# Altium project IV_transform_circuit.PrjPcb
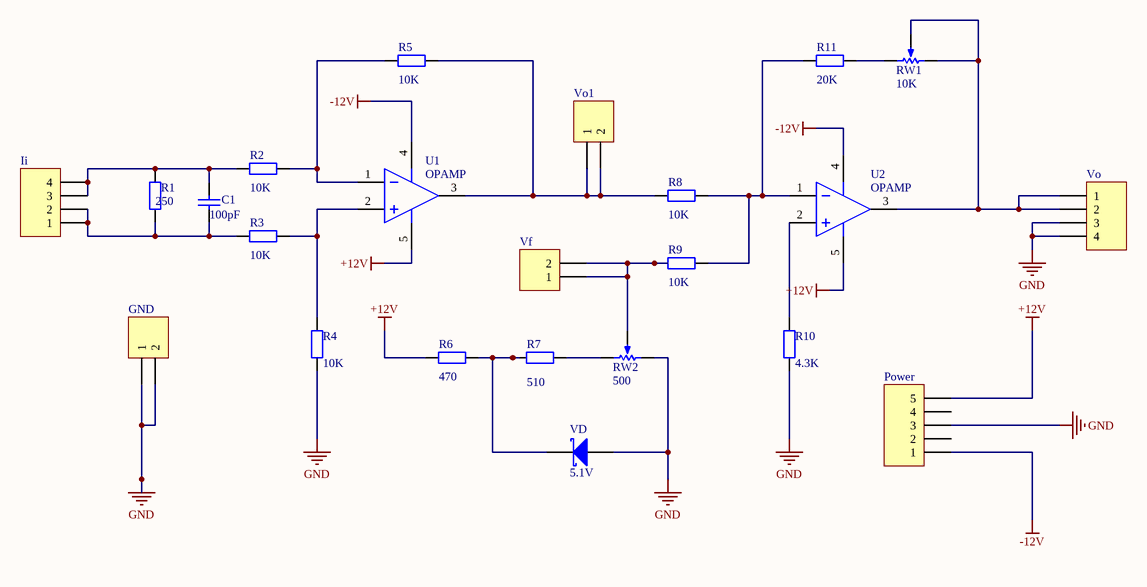
[diagram p0: IV_transform_circuit.SchDoc]
1 sheet, 23 parts. Net scope: global (net labels, ports and power ports of the same name join across sheets).
Board file: IV_transform_circuit.PcbDoc

## Sheet IV_transform_circuit.SchDoc
size A4; SheetNumber: 1; SheetTotal: 1

### Parts
C1  value 100pF  [RAD-0.2]  (hidden comment: Cap)
GND  Header 2  [SIP-2]  (value not drawn)
Ii  Header 4  [SIP-4]  (value not drawn)
Power  Header 5  [POWER PLUG5]  (value not drawn)
R1  value 250  [AXIAL-0.4]
R2  value 10K  [AXIAL-0.4]  (hidden comment: Res2)
R3  value 10K  [AXIAL-0.4]  (hidden comment: Res2)
R4  value 10K  [AXIAL-0.4]  (hidden comment: Res2)
R5  value 10K  [AXIAL-0.4]  (hidden comment: Res2)
R6  value 470  [AXIAL-0.4]  (hidden comment: Res2)
R7  value 510  [AXIAL-0.4]  (hidden comment: Res2)
R8  value 10K  [AXIAL-0.4]  (hidden comment: Res2)
R9  value 10K  [AXIAL-0.4]  (hidden comment: Res2)
R10  value 4.3K  [AXIAL-0.4]  (hidden comment: Res2)
R11  value 20K  [AXIAL-0.4]  (hidden comment: Res2)
RW1  value 10K  [VR5]  (hidden comment: RPot)
RW2  value 500  [VR5]  (hidden comment: RPot)
U1  OPAMP  [DIP-8]
U2  OPAMP  [DIP-8]
VD  5.1V  [DIODE-0.4]
Vf  Header 2  [SIP-2]  (value not drawn)
Vo  Header 4  [SIP-4]  (value not drawn)
Vo1  Header 2  [SIP-2]  (value not drawn)

### Nets
+12V: Power.5 R6.2 U1.5(V-) U2.5(V-)
-12V: Power.1 U1.4(V+) U2.4(V+)
GND: GND.1 GND.2 Power.3 R4.2 R10.2 RW2.1(TOP) VD.1(A) Vo.3 Vo.4
NetC1_1: C1.1 Ii.1 Ii.2 R1.1 R3.2
NetC1_2: C1.2 Ii.3 Ii.4 R1.2 R2.2
NetR2_1: R2.1 R5.2 U1.1(IN-)
NetR3_1: R3.1 R4.1 U1.2(IN+)
NetR5_1: R5.1 R8.2 U1.3(OUT) Vo1.1 Vo1.2
NetR6_1: R6.1 R7.2 VD.2(K)
NetR7_1: R7.1 RW2.2(BOT)
NetR8_1: R8.1 R9.1 R11.2 U2.1(IN-)
NetR9_2: R9.2 RW2.3(TAP) Vf.1 Vf.2
NetR10_1: R10.1 U2.2(IN+)
NetR11_1: R11.1 RW1.2(BOT)
NetRW1_1: RW1.1(TOP) RW1.3(TAP) U2.3(OUT) Vo.1 Vo.2

Not connected (* = marked no-connect by the designer): Power 2 4

### Library data of the parts
C1 = Cap: Capacitor; Published: 8-Jun-2000; LatestRevisionDate: 17-Jul-2002; LatestRevisionNote: Re-released for DXP Platform.; PackageReference: RAD-0.3; Publisher: Altium Limited; PackageDescription: Radial Cap, Thru-Hole; 2 Leads; 0.3 in Pin Spacing
GND Vf Vo1 = Header 2: Header, 2-Pin; LatestRevisionDate: 17-Jul-2002; LatestRevisionNote: Re-released for DXP Platform.; Publisher: Altium Limited
Ii Vo = Header 4: Header, 4-Pin; LatestRevisionDate: 17-Jul-2002; LatestRevisionNote: Re-released for DXP Platform.; Publisher: Altium Limited
Power = Header 5: Header, 5-Pin; LatestRevisionDate: 17-Jul-2002; LatestRevisionNote: Re-released for DXP Platform.; Publisher: Altium Limited
R1-R11 = Res2: Resistor; Published: 8-Jun-2000; LatestRevisionDate: 17-Jul-2002; LatestRevisionNote: Re-released for DXP Platform.; PackageReference: AXIAL-0.4; Publisher: Altium Limited; PackageDescription: Axial Device, Thru-Hole; 2 Leads; 0.4 in Pin Spacing
RW1 RW2 = RPot: Potentiometer; pin to pad: 2>3 3>2; Sim Note: Enter the Resistance value and the set point into parameter fields.; Set Position: 0.5; Published: 8-Jun-2000; LatestRevisionDate: 17-Jul-2002; LatestRevisionNote: Re-released for DXP Platform.; PackageReference: VR5; Publisher: Altium Limited; PackageDescription: Variable Resistor, Thru-Hole; 3 Leads
U1 U2 = OPAMP: Operational Amplifier; pin to pad: 1>2 2>3 3>6 5>7
VD = D Schottky: Schottky Diode; Published: 8-Jun-2000; LatestRevisionDate: 17-Jul-2002; LatestRevisionNote: Re-released for DXP Platform.; PackageReference: SMB; Publisher: Altium Limited; PackageDescription: DO-214-AA/SMB; 2 C-Bend Leads; Body 5.3 x 3.6 mm, inc. leads (LxW); Code_JEDEC: DO-214-AA